# Altium project Rocket_PCB_Project_2017_Power_board.PrjPcb
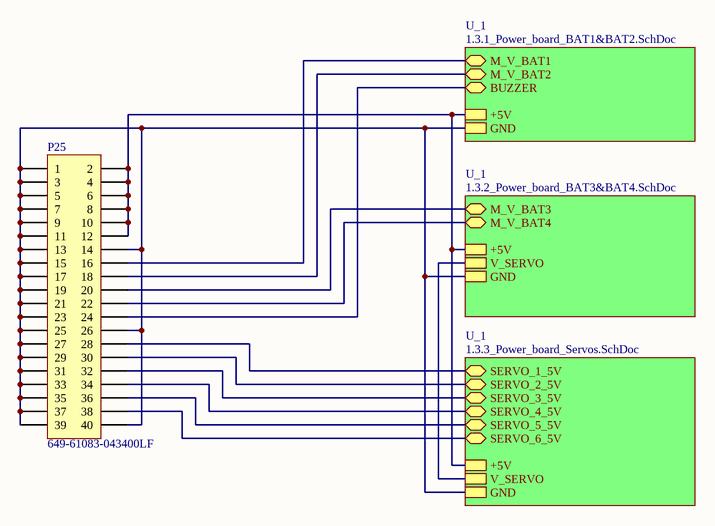
[diagram p0: 1.3.0_Power_board.SchDoc]
4 sheets, 132 parts. Net scope: hierarchical (ports join the sheet entries above them; power ports are global).
Board file: Power_board.PcbDoc
Sheets:
  1.3.0_Power_board.SchDoc
    U_1 = 1.3.3_Power_board_Servos.SchDoc
    U_1 = 1.3.1_Power_board_BAT1&BAT2.SchDoc
    U_1 = 1.3.2_Power_board_BAT3&BAT4.SchDoc

## Sheet 1.3.0_Power_board.SchDoc
size A4; DocumentNumber: 11; SheetNumber: 11; SheetTotal: 14

### Parts
P25  Supplier Part Number 1: 649-61083-043400LF  [61083-043400LF]  (hidden comment: 61083-043400LF)

### Sub-sheets
U_1 = 1.3.3_Power_board_Servos.SchDoc: SERVO_1_5V (bidir), SERVO_2_5V (bidir), SERVO_3_5V (bidir), SERVO_4_5V (bidir), SERVO_5_5V (bidir), SERVO_6_5V (bidir), GND, +5V, V_SERVO
U_1 = 1.3.1_Power_board_BAT1&BAT2.SchDoc: BUZZER (bidir), M_V_BAT1 (bidir), M_V_BAT2 (bidir), GND, +5V
U_1 = 1.3.2_Power_board_BAT3&BAT4.SchDoc: M_V_BAT3 (bidir), GND, +5V, M_V_BAT4 (bidir), V_SERVO

### Nets
+5V: P25.2 P25.4 P25.6 P25.8 P25.10 P25.12 ; sheet U_1/+5V, sheet U_1/+5V, sheet U_1/+5V
GND: P25.1 P25.3 P25.5 P25.7 P25.9 P25.11 P25.13 P25.14 P25.15 P25.17 P25.19 P25.21 P25.23 P25.25 P25.26 P25.27 P25.29 P25.31 P25.33 P25.35 P25.37 P25.39 P25.40 ; sheet U_1/GND, sheet U_1/GND, sheet U_1/GND
V_SERVO: sheet U_1/V_SERVO, sheet U_1/V_SERVO
NetC70_2: P25.16 ; sheet U_1/M_V_BAT1
NetC74_2: P25.18 ; sheet U_1/M_V_BAT2
NetC91_2: P25.20 ; sheet U_1/M_V_BAT3
NetC94_2: P25.22 ; sheet U_1/M_V_BAT4
NetP25_24: P25.24 ; sheet U_1/BUZZER
NetP25_28: P25.28 ; sheet U_1/SERVO_1_5V
NetP25_30: P25.30 ; sheet U_1/SERVO_2_5V
NetP25_32: P25.32 ; sheet U_1/SERVO_3_5V
NetP25_34: P25.34 ; sheet U_1/SERVO_4_5V
NetP25_36: P25.36 ; sheet U_1/SERVO_5_5V
NetP25_38: P25.38 ; sheet U_1/SERVO_6_5V

### Library data of the parts
P25 = 61083-043400LF: Connecteurs carte à carte et mezzanine PLUG 40P; Supplier 1: Mouser

## Sheet 1.3.3_Power_board_Servos.SchDoc
size A4; DocumentNumber: 14; SheetNumber: 14; SheetTotal: 14
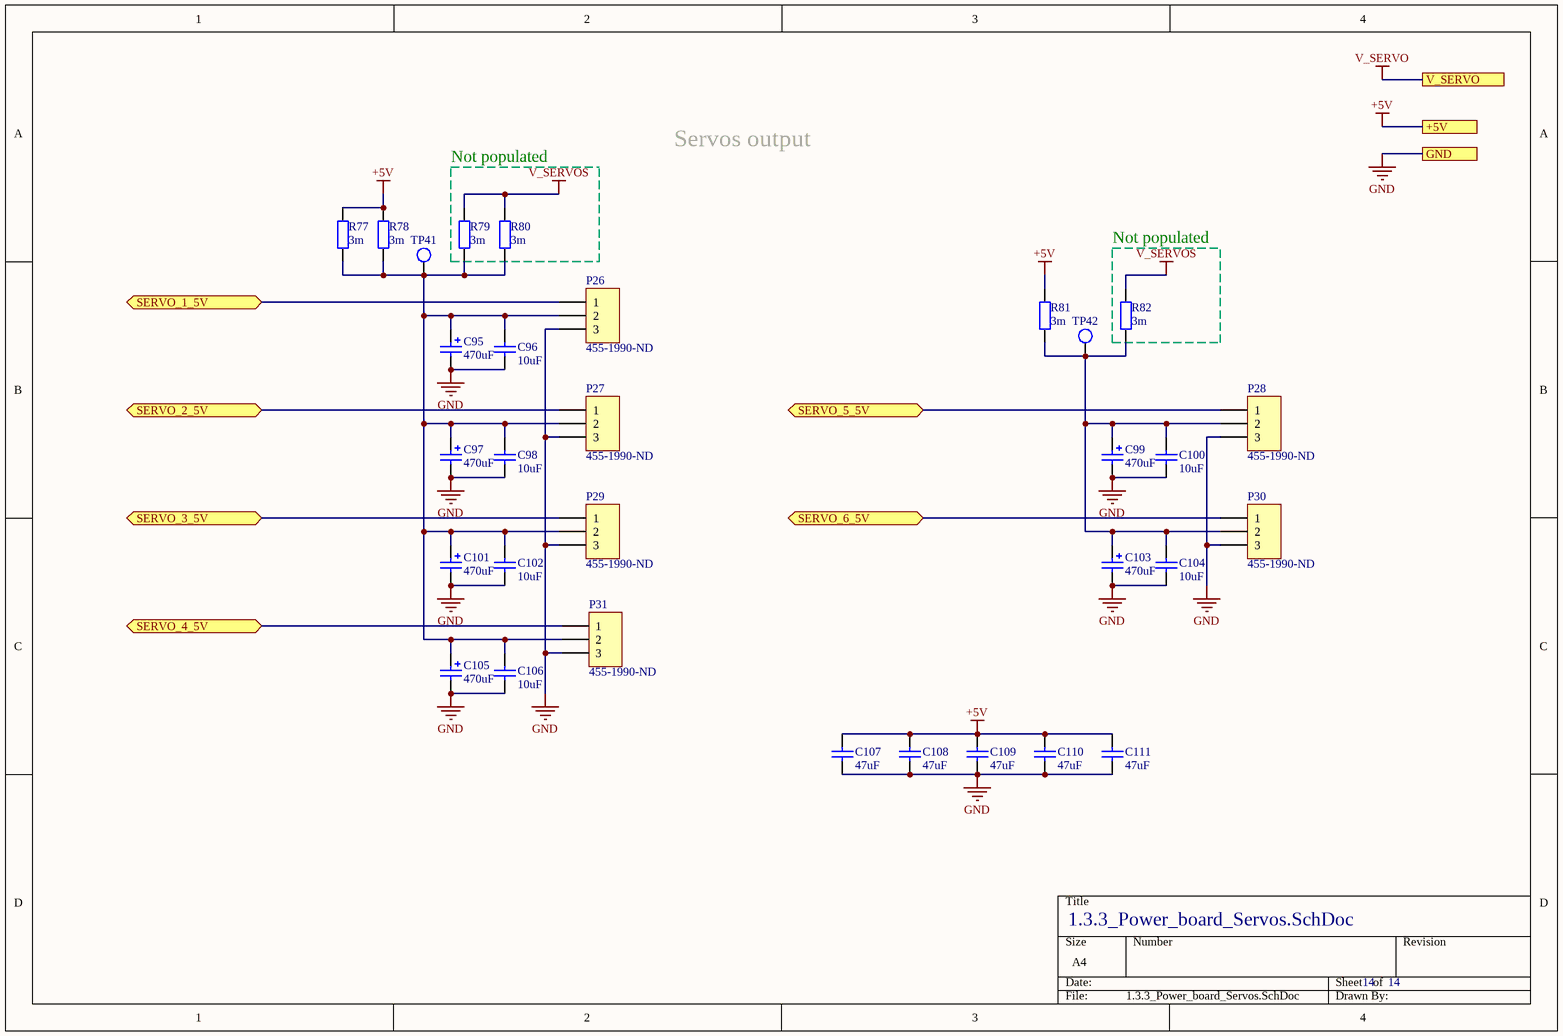
[diagram p1: 1.3.3_Power_board_Servos.SchDoc]

### Parts
C95  470uF  [PCV_10x10]
C96  10uF  [CAP0805W]
C97  470uF  [PCV_10x10]
C98  10uF  [CAP0805W]
C99  470uF  [PCV_10x10]
C100  10uF  [CAP0805W]
C101  470uF  [PCV_10x10]
C102  10uF  [CAP0805W]
C103  470uF  [PCV_10x10]
C104  10uF  [CAP0805W]
C105  470uF  [PCV_10x10]
C106  10uF  [CAP0805W]
C107  47uF  [CAP1206W]
C108  47uF  [CAP1206W]
C109  47uF  [CAP1206W]
C110  47uF  [CAP1206W]
C111  47uF  [CAP1206W]
P26  Supplier Part Number 1: 455-1990-ND  [CON_JST_XA_ B03B-XASK]  (hidden comment: Header 3p JST XA 3A)
P27  Supplier Part Number 1: 455-1990-ND  [CON_JST_XA_ B03B-XASK]  (hidden comment: Header 3p JST XA 3A)
P28  Supplier Part Number 1: 455-1990-ND  [CON_JST_XA_ B03B-XASK]  (hidden comment: Header 3p JST XA 3A)
P29  Supplier Part Number 1: 455-1990-ND  [CON_JST_XA_ B03B-XASK]  (hidden comment: Header 3p JST XA 3A)
P30  Supplier Part Number 1: 455-1990-ND  [CON_JST_XA_ B03B-XASK]  (hidden comment: Header 3p JST XA 3A)
P31  Supplier Part Number 1: 455-1990-ND  [CON_JST_XA_ B03B-XASK]  (hidden comment: Header 3p JST XA 3A)
R77  3m  [2010]
R78  3m  [2010]
R79  3m  [2010]
R80  3m  [2010]
R81  3m  [2010]
R82  3m  [2010]
TP41  Test point  [TP]  (value not drawn)
TP42  Test point  [TP]  (value not drawn)

### Blocks framed on the sheet
Not populated: R79 R80
Not populated: R82

### Ports
+5V, GND, SERVO_1_5V (bidir), SERVO_2_5V (bidir), SERVO_3_5V (bidir), SERVO_4_5V (bidir), SERVO_5_5V (bidir), SERVO_6_5V (bidir), V_SERVO

### Nets
+5V: C107.2 C108.2 C109.2 C110.2 C111.2 R77.2 R78.2 R81.2 ; port +5V
GND: C95.2 C96.1 C97.2 C98.1 C99.2 C100.1 C101.2 C102.1 C103.2 C104.1 C105.2 C106.1 C107.1 C108.1 C109.1 C110.1 C111.1 P26.3 P27.3 P28.3 P29.3 P30.3 P31.3 ; port GND
V_SERVOS: R79.2 R80.2 R82.2
NetC95_1: C95.1 C96.2 C97.1 C98.2 C101.1 C102.2 C105.1 C106.2 P26.2 P27.2 P29.2 P31.2 R77.1 R78.1 R79.1 R80.1 TP41.1
NetC99_1: C99.1 C100.2 C103.1 C104.2 P28.2 P30.2 R81.1 R82.1 TP42.1
NetP25_28: P26.1 ; port SERVO_1_5V
NetP25_30: P27.1 ; port SERVO_2_5V
NetP25_32: P29.1 ; port SERVO_3_5V
NetP25_34: P31.1 ; port SERVO_4_5V
NetP25_36: P28.1 ; port SERVO_5_5V
NetP25_38: P30.1 ; port SERVO_6_5V

### Notes on the sheet
- Servos output

### Library data of the parts
C95 C97 C99 C101 C103 C105 = C_pol_470uF_elec: Polarized Capacitor; Supplier 1: Mouser; Supplier Part Number 1: 647-UWT1E471MNL1S
C96 C98 C100 C102 C104 C106 = C_10uF_16v: Capacitor; Supplier 1: Mouser; Supplier Part Number 1: 81-GRT21BC81C106ME1L
C107-C111 = C_47uF_25v_1206: Capacitor; Supplier 1: Mouser; Supplier Part Number 1: 810-C3216X5R1E476M
R77-R82 = R_2010_2W_3mOhm: 2W 3mOhm; Supplier 1: Mouser; Supplier Part Number 1: 667-ERJ-MP3PF3M0U
P26-P31 = Header 3p JST XA 3A: Supplier 1: Digi-Key

## Sheet 1.3.1_Power_board_BAT1&BAT2.SchDoc
size A4; DocumentNumber: 12; SheetNumber: 12; SheetTotal: 14
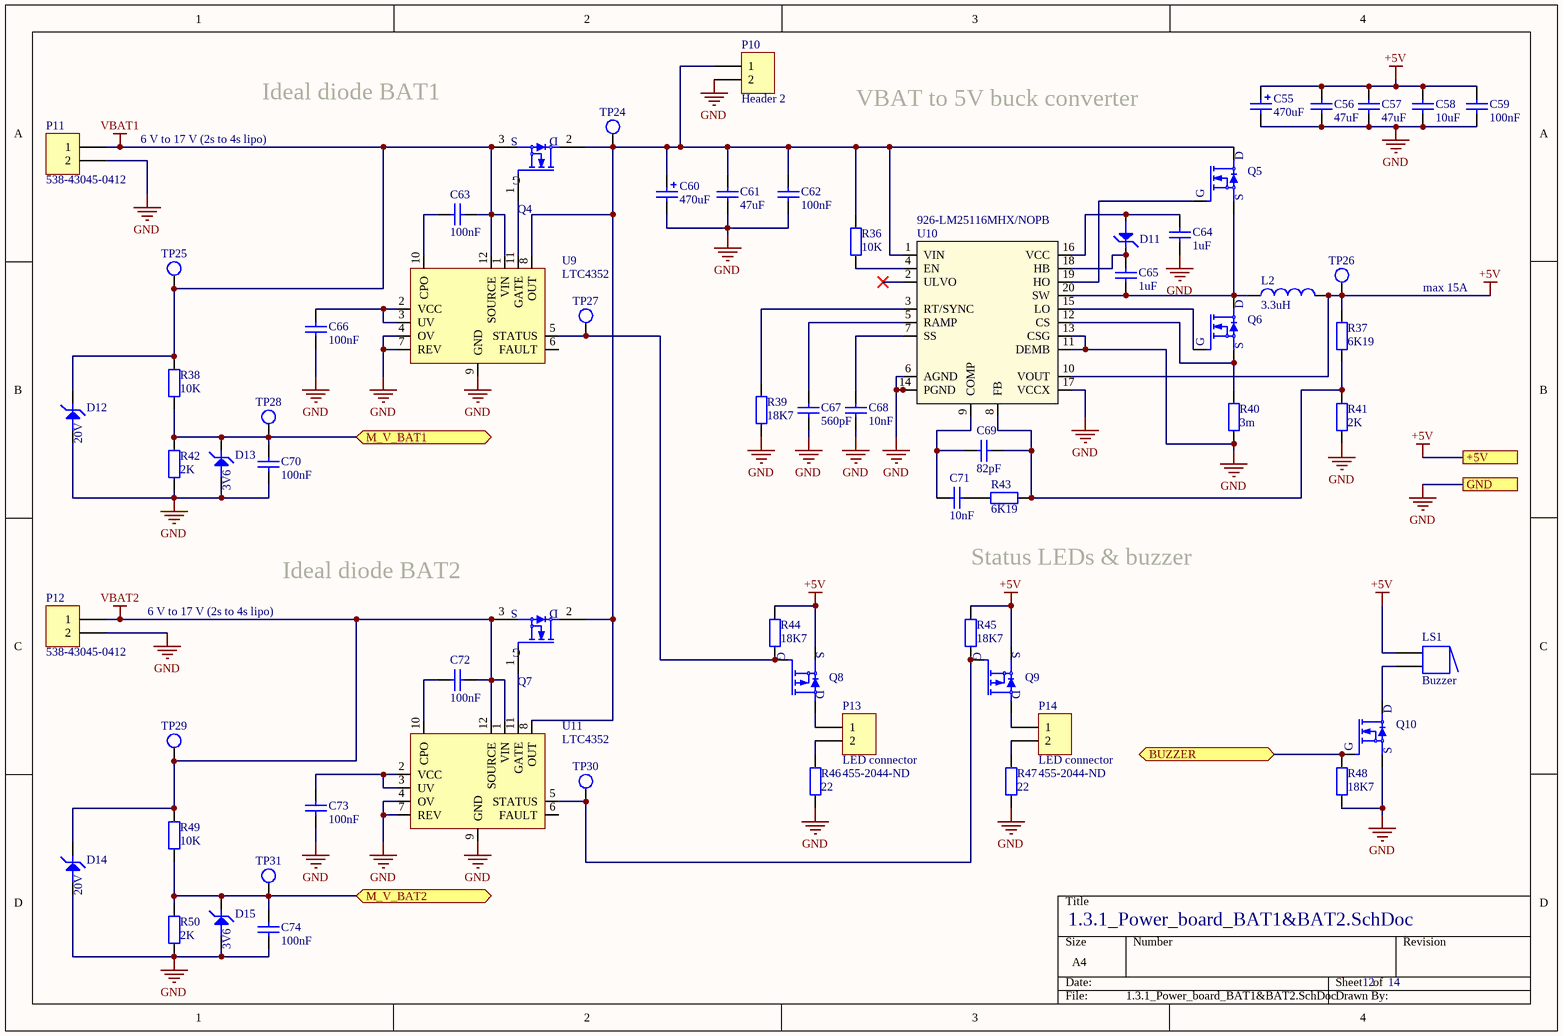
[diagram p2: 1.3.1_Power_board_BAT1&BAT2.SchDoc]

### Parts
C55  470uF  [PCV_10x10]
C56  47uF  [CAP1206W]
C57  47uF  [CAP1206W]
C58  10uF  [CAP0805W]
C59  100nF  [CAP0603R]
C60  470uF  [PCV_10x10]
C61  47uF  [CAP1206W]
C62  100nF  [CAP0603R]
C63  100nF  [CAP0603R]
C64  1uF  [CAP0603R]
C65  1uF  [CAP0603R]
C66  100nF  [CAP0603R]
C67  560pF  [CAP0603R]
C68  10nF  [CAP0603R]
C69  82pF  [CAP0603R]
C70  100nF  [CAP0603R]
C71  10nF  [CAP0603R]
C72  100nF  [CAP0603R]
C73  100nF  [CAP0603R]
C74  100nF  [CAP0603R]
D11  DS_NRVB0530T3G  [SOD123]  (value not drawn)
D12  20V  [DO-214AA]
D13  3V6  [SOT23]
D14  20V  [DO-214AA]
D15  3V6  [SOT23]
L2  3.3uH  [IHLP_Inductor]
LS1  Buzzer  [CT-1205C-SMT]
P10  Header 2  [Con Prov 2P Power]
P11  Supplier Part Number 1: 538-43045-0412  [Con 2P Power and MicroFit 4P]  (hidden comment: Header MicroFit 2)
P12  Supplier Part Number 1: 538-43045-0412  [Con 2P Power and MicroFit 4P]  (hidden comment: Header MicroFit 2)
P13  LED connector  Supplier Part Number 1: 455-2044-ND  [CON_JST_XA_ S02B-XASS-1]
P14  LED connector  Supplier Part Number 1: 455-2044-ND  [CON_JST_XA_ S02B-XASS-1]
Q4  MOSFET_N  [TO220]  (value not drawn)
Q5  MOSFET_N  [TO252]  (value not drawn)
Q6  MOSFET_N  [TO252]  (value not drawn)
Q7  MOSFET_N  [TO220]  (value not drawn)
Q8  MOSFET_P  [SOT23]  (value not drawn)
Q9  MOSFET_P  [SOT23]  (value not drawn)
Q10  MOSFET_N  [SOT-323-3]  (value not drawn)
R36  10K  [0603]
R37  6K19  [0603]
R38  10K  [0603]
R39  18K7  [0603]
R40  3m  [2010]
R41  2K  [0603]
R42  2K  [0603]
R43  6K19  [0603]
R44  18K7  [0603]
R45  18K7  [0603]
R46  22  [0603]
R47  22  [0603]
R48  18K7  [0603]
R49  10K  [0603]
R50  2K  [0603]
TP24  Test point  [TP]  (value not drawn)
TP25  Test point  [TP]  (value not drawn)
TP26  Test point  [TP]  (value not drawn)
TP27  Test point  [TP]  (value not drawn)
TP28  Test point  [TP]  (value not drawn)
TP29  Test point  [TP]  (value not drawn)
TP30  Test point  [TP]  (value not drawn)
TP31  Test point  [TP]  (value not drawn)
U9  LTC4352  [TSOP612]
U10  Supplier Part Number 1: 926-LM25116MHX/NOPB  [HTSSOP 20]  (hidden comment: LM25116MHX/NOPB)
U11  LTC4352  [TSOP612]

### Ports
+5V, BUZZER (bidir), GND, M_V_BAT1 (bidir), M_V_BAT2 (bidir)

### Nets
+5V: C55.1 C56.2 C57.2 C58.2 C59.2 L2.2 LS1.1 Q8.2(S) Q9.2(S) R37.2 R44.2 R45.2 TP26.1 U10.10(VOUT) ; port +5V
GND: C55.2 C56.1 C57.1 C58.1 C59.1 C60.2 C61.1 C62.1 C64.1 C66.1 C67.1 C68.1 C70.1 C73.1 C74.1 D12.A D13.1 D14.A D15.1 P10.2 P11.2 P12.2 Q10.2(S) R39.1 R40.1 R41.1 R42.1 R46.1 R47.1 R48.1 R50.1 U9.4(OV) U9.7(REV) U9.9(GND) U10.6(AGND) U10.11(DEMB) U10.13(CSG) U10.14(PGND) U10.17(VCCX) U10.21(EP) U11.4(OV) U11.7(REV) U11.9(GND) ; port GND
VBAT1: C63.1 D12.C P11.1 Q4.3(S) R38.2 TP25.1 U9.1(VIN) U9.12(SOURCE)
VBAT2: C72.1 D14.C P12.1 Q7.3(S) R49.2 TP29.1 U11.1(VIN) U11.12(SOURCE)
NetC60_1: C60.1 C61.2 C62.2 P10.1 Q4.2(D) Q5.D Q7.2(D) R36.2 TP24.1 U9.8(OUT) U10.1(VIN) U11.8(OUT)
NetC63_2: C63.2 U9.10(CPO)
NetC64_2: C64.2 D11.2 U10.16(VCC)
NetC65_1: C65.1 L2.1 Q5.S Q6.D U10.20(SW)
NetC65_2: C65.2 D11.1 U10.18(HB)
NetC66_2: C66.2 U9.2(VCC) U9.3(UV)
NetC67_2: C67.2 U10.5(RAMP)
NetC68_2: C68.2 U10.7(SS)
NetC69_1: C69.1 R37.1 R41.2 R43.2 U10.8(FB)
NetC69_2: C69.2 C71.2 U10.9(COMP)
NetC70_2: C70.2 D13.3 R38.1 R42.2 TP28.1 ; port M_V_BAT1
NetC71_1: C71.1 R43.1
NetC72_2: C72.2 U11.10(CPO)
NetC73_2: C73.2 U11.2(VCC) U11.3(UV)
NetC74_2: C74.2 D15.3 R49.1 R50.2 TP31.1 ; port M_V_BAT2
NetLS1_2: LS1.2 Q10.3(D)
NetP13_1: P13.1 Q8.3(D)
NetP13_2: P13.2 R46.2
NetP14_1: P14.1 Q9.3(D)
NetP14_2: P14.2 R47.2
NetP25_24: Q10.1(G) R48.2 ; port BUZZER
NetQ4_1: Q4.1(G) U9.11(GATE)
NetQ5_G: Q5.G U10.19(HO)
NetQ6_G: Q6.G U10.15(LO)
NetQ6_S: Q6.S R40.2 U10.12(CS)
NetQ7_1: Q7.1(G) U11.11(GATE)
NetQ8_1: Q8.1(G) R44.1 TP27.1 U9.5(STATUS)
NetQ9_1: Q9.1(G) R45.1 TP30.1 U11.5(STATUS)
NetR36_1: R36.1 U10.4(EN)
NetR39_2: R39.2 U10.3(RT/SYNC)

Not connected (* = marked no-connect by the designer): U9 6(FAULT); U10 2(ULVO)*; U11 6(FAULT)

### Notes on the sheet
- Ideal diode BAT1
- VBAT to 5V buck converter
- 6 V to 17 V (2s to 4s lipo)
- max 15A
- (near Q7) Ideal diode BAT2
- Status LEDs & buzzer

### Library data of the parts
C55 C60 = C_pol_470uF_elec: Polarized Capacitor; Supplier 1: Mouser; Supplier Part Number 1: 647-UWT1E471MNL1S
C56 C57 C61 = C_47uF_25v_1206: Capacitor; Supplier 1: Mouser; Supplier Part Number 1: 810-C3216X5R1E476M
C58 = C_10uF_16v: Capacitor; Supplier 1: Mouser; Supplier Part Number 1: 81-GRT21BC81C106ME1L
C59 C62 C63 C66 C70 C72-C74 = C_100nF: Capacitor; Supplier 1: Mouser; Supplier Part Number 1: 81-GCG188R91H104KA1D
C64 C65 = C_1uF_50v: Capacitor; Supplier 1: Mouser; Supplier Part Number 1: 81-GRT188R61H105ME3D
C67 = C_560pF_50V: Capacitor; Supplier 1: Mouser; Supplier Part Number 1: 81-GCM1885C1H561JA6D
C68 C71 = C_10nF: Capacitor; Supplier 1: Mouser; Supplier Part Number 1: 81-GCG188R91H103KA3D
C69 = C_82pF_50V: Capacitor; Supplier 1: Mouser; Supplier Part Number 1: 81-GCM1885C1H820JA6D
D12 D14 = DZ_20V: Zener Diodes 5W 20V; Supplier 1: Mouser; Supplier Part Number 1: 833-SMBJ5357B-TP
D13 D15 = DZ_3V6_MMBZ522: Zener Diodes 3.6V 225mW; Supplier 1: Mouser; Supplier Part Number 1: 863-MMBZ5227BLT1G
L2 = L_3.3uH: Inductor; Supplier 1: Mouser; Supplier Part Number 1: 70-IHLP6767DZER3R3M1
LS1 = Buzzer_CT-1205C-SMT-TR: Magnetic Transducer Buzzer 5VDC; Supplier 1: Mouser; Supplier Part Number 1: 490-CT-1205C-SMT-TR
P10 = Header 2: Juste pour tester!!!
P11 P12 = MicroFit and other Headers 2p: Supplier 1: Mouser
P13 P14 = Header 2p JST XA 3A right angle: Supplier 1: Digi-Key
Q4 Q7 = MOSFET_IPP029N06NAKSA1: Supplier 1: Mouser; Supplier Part Number 1: 726-IPP029N06NAKSA1
Q5 Q6 = MOSFET_DMTH4007LK3-13: Supplier 1: Mouser; Supplier Part Number 1: 621-DMTH4007LK3-13
Q8 Q9 = MOSFET_P_ 20V_1.5A: MOSFET 40V P-channel Trench MOSFET SOT-23-3; Supplier 1: Mouser; Supplier Part Number 1: 771-PMV250EPEAR
Q10 = MOSFET_N_ 20V_1.4A: MOSFET N-Ch 20V 1.4A SOT-323-3; Supplier 1: Mouser; Supplier Part Number 1: 726-SP000917562
R36 R38 R49 = R_0603_01W_10K: 0.1W 10K; Supplier 1: Mouser; Supplier Part Number 1: 667-ERJ-3GEYJ103V
R37 R43 = R_0603_01W_6K2: 0.1W 6K19; Supplier 1: Mouser; Supplier Part Number 1: 667-ERJ-3EKF6191V
R39 R44 R45 R48 = R_0603_01W_18K7: 0.1W 18K7; Supplier 1: Mouser; Supplier Part Number 1: 667-ERJ-3EKF1872V
R40 = R_2010_2W_3mOhm: 2W 3mOhm; Supplier 1: Mouser; Supplier Part Number 1: 667-ERJ-MP3PF3M0U
R41 R42 R50 = R_0603_01W_2K: 0.1W 2K; Supplier 1: Mouser; Supplier Part Number 1: 667-ERJ-3EKF2001V
R46 R47 = R_0603_025W_22Ohm: 0.25W 22Ohm; LatestRevisionDate: 17-Jul-2002; LatestRevisionNote: Re-released for DXP Platform.; PackageReference: AXIAL-0.4; PackageDescription: Axial Device, Thru-Hole; 2 Leads; 0.4 in Pin Spacing; Supplier 1: Mouser; Supplier Part Number 1: 667-ERJ-PA3J220V
U10 = LM25116MHX/NOPB: WIDE RANGE SYNC BUCK; Supplier 1: Mouser
D11 = DS_NRVB0530T3G: Supplier 1: Mouser; Supplier Part Number 1: 863-NRVB0530T3G
U9 U11 = LTC4352: Supplier 1: Digi-Key; Supplier Part Number 1: LTC4352IMS#PBF-ND

## Sheet 1.3.2_Power_board_BAT3&BAT4.SchDoc
size A4; DocumentNumber: 13; SheetNumber: 13; SheetTotal: 14
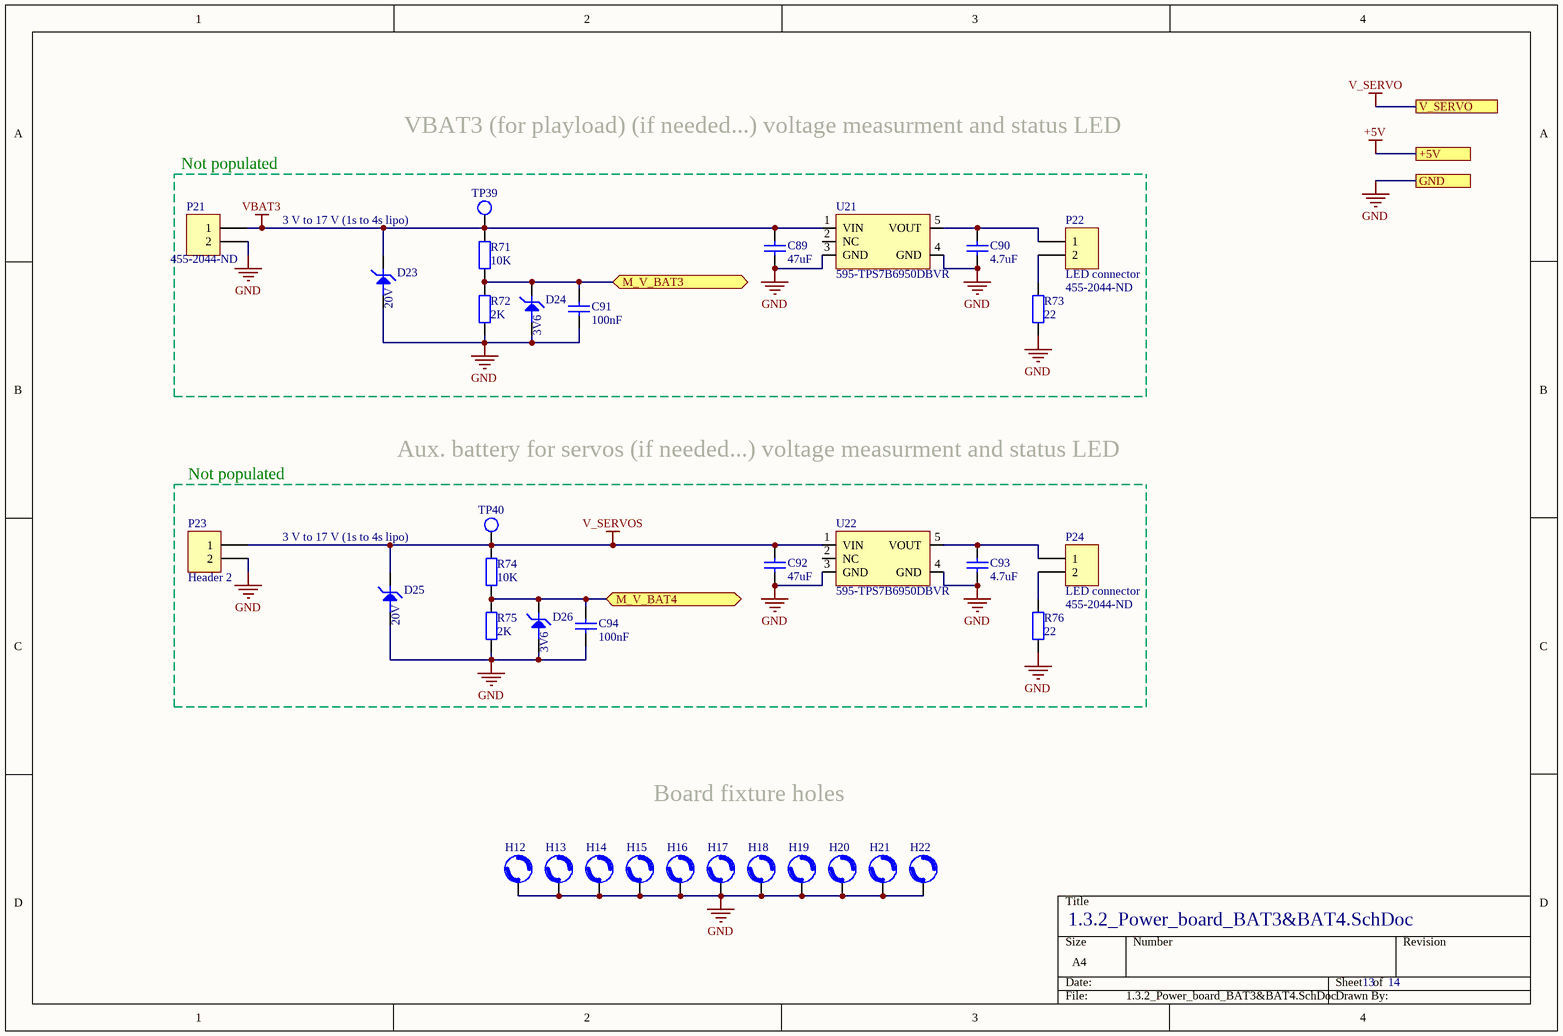
[diagram p3: 1.3.2_Power_board_BAT3&BAT4.SchDoc]

### Parts
C89  47uF  [CAP1206W]
C90  4.7uF  [CAP0805W]
C91  100nF  [CAP0603R]
C92  47uF  [CAP1206W]
C93  4.7uF  [CAP0805W]
C94  100nF  [CAP0603R]
D23  20V  [DO-214AA]
D24  3V6  [SOT23]
D25  20V  [DO-214AA]
D26  3V6  [SOT23]
H12  Hole_3.2mm  [HOLE_3.2mm]  (value not drawn)
H13  Hole_3.2mm  [HOLE_3.2mm]  (value not drawn)
H14  Hole_3.2mm  [HOLE_3.2mm]  (value not drawn)
H15  Hole_3.2mm  [HOLE_3.2mm]  (value not drawn)
H16  Hole_3.2mm  [HOLE_3.2mm]  (value not drawn)
H17  Hole_3.2mm  [HOLE_3.2mm]  (value not drawn)
H18  Hole_3.2mm  [HOLE_3.2mm]  (value not drawn)
H19  Hole_3.2mm  [HOLE_3.2mm]  (value not drawn)
H20  Hole_3.2mm  [HOLE_3.2mm]  (value not drawn)
H21  Hole_3.2mm  [HOLE_3.2mm]  (value not drawn)
H22  Hole_3.2mm  [HOLE_3.2mm]  (value not drawn)
P21  Supplier Part Number 1: 455-2044-ND  [CON_JST_XA_ S02B-XASS-1]
P22  LED connector  Supplier Part Number 1: 455-2044-ND  [CON_JST_XA_ S02B-XASS-1]
P23  Header 2  [Con Prov 2P Power]
P24  LED connector  Supplier Part Number 1: 455-2044-ND  [CON_JST_XA_ S02B-XASS-1]
R71  10K  [0603]
R72  2K  [0603]
R73  22  [0603]
R74  10K  [0603]
R75  2K  [0603]
R76  22  [0603]
TP39  Test point  [TP]  (value not drawn)
TP40  Test point  [TP]  (value not drawn)
U21  Supplier Part Number 1: 595-TPS7B6950DBVR  [SOT-23-5]  (hidden comment: TPS7B6950D)
U22  Supplier Part Number 1: 595-TPS7B6950DBVR  [SOT-23-5]  (hidden comment: TPS7B6950D)

### Blocks framed on the sheet
Not populated: C89-C91 D23 D24 P21 P22 R71-R73 TP39 U21
Not populated: C92-C94 D25 D26 P23 P24 R74-R76 TP40 U22

### Ports
+5V, GND, M_V_BAT3 (bidir), M_V_BAT4 (bidir), V_SERVO

### Nets
GND: C89.1 C90.1 C91.1 C92.1 C93.1 C94.1 D23.A D24.1 D25.A D26.1 H12.0 H13.0 H14.0 H15.0 H16.0 H17.0 H18.0 H19.0 H20.0 H21.0 H22.0 P21.2 P23.2 R72.1 R73.1 R75.1 R76.1 U21.3(GND) U21.4(GND) U22.3(GND) U22.4(GND) ; port GND
V_SERVOS: C92.2 D25.C P23.1 R74.2 TP40.1 U22.1(VIN)
VBAT3: C89.2 D23.C P21.1 R71.2 TP39.1 U21.1(VIN)
NetC90_2: C90.2 P22.1 U21.5(VOUT)
NetC91_2: C91.2 D24.3 R71.1 R72.2 ; port M_V_BAT3
NetC93_2: C93.2 P24.1 U22.5(VOUT)
NetC94_2: C94.2 D26.3 R74.1 R75.2 ; port M_V_BAT4
NetP22_2: P22.2 R73.2
NetP24_2: P24.2 R76.2

Not connected (* = marked no-connect by the designer): U21 2(NC); U22 2(NC)

### Notes on the sheet
- VBAT3 (for playload) (if needed...) voltage measurment and status LED
- 3 V to 17 V (1s to 4s lipo)
- Aux. battery for servos (if needed...) voltage measurment and status LED
- Board fixture holes

### Library data of the parts
C89 C92 = C_47uF_25v_1206: Capacitor; Supplier 1: Mouser; Supplier Part Number 1: 810-C3216X5R1E476M
C90 C93 = C_4.7uF_16v: Capacitor; Supplier 1: Mouser; Supplier Part Number 1: 81-GCG21BR71C475KA2L
C91 C94 = C_100nF: Capacitor; Supplier 1: Mouser; Supplier Part Number 1: 81-GCG188R91H104KA1D
D23 D25 = DZ_20V: Zener Diodes 5W 20V; Supplier 1: Mouser; Supplier Part Number 1: 833-SMBJ5357B-TP
D24 D26 = DZ_3V6_MMBZ522: Zener Diodes 3.6V 225mW; Supplier 1: Mouser; Supplier Part Number 1: 863-MMBZ5227BLT1G
P21 P22 P24 = Header 2p JST XA 3A right angle: Supplier 1: Digi-Key
P23 = Header 2: Juste pour tester!!!
R71 R74 = R_0603_01W_10K: 0.1W 10K; Supplier 1: Mouser; Supplier Part Number 1: 667-ERJ-3GEYJ103V
R72 R75 = R_0603_01W_2K: 0.1W 2K; Supplier 1: Mouser; Supplier Part Number 1: 667-ERJ-3EKF2001V
R73 R76 = R_0603_025W_22Ohm: 0.25W 22Ohm; LatestRevisionDate: 17-Jul-2002; LatestRevisionNote: Re-released for DXP Platform.; PackageReference: AXIAL-0.4; PackageDescription: Axial Device, Thru-Hole; 2 Leads; 0.4 in Pin Spacing; Supplier 1: Mouser; Supplier Part Number 1: 667-ERJ-PA3J220V
U21 U22 = TPS7B6950D: LDO 5V 150mA; Supplier 1: Mouser

## Nets that join several sheets
+5V: 1.3.0_Power_board (6 pins), 1.3.3_Power_board_Servos (8 pins), 1.3.1_Power_board_BAT1&BAT2 (14 pins)
GND: 1.3.0_Power_board (23 pins), 1.3.3_Power_board_Servos (23 pins), 1.3.1_Power_board_BAT1&BAT2 (43 pins), 1.3.2_Power_board_BAT3&BAT4 (31 pins)
V_SERVOS: 1.3.3_Power_board_Servos (R79.2 R80.2 R82.2), 1.3.2_Power_board_BAT3&BAT4 (6 pins)
NetC70_2: 1.3.0_Power_board (P25.16), 1.3.1_Power_board_BAT1&BAT2 (5 pins)
NetC74_2: 1.3.0_Power_board (P25.18), 1.3.1_Power_board_BAT1&BAT2 (5 pins)
NetC91_2: 1.3.0_Power_board (P25.20), 1.3.2_Power_board_BAT3&BAT4 (C91.2 D24.3 R71.1 R72.2)
NetC94_2: 1.3.0_Power_board (P25.22), 1.3.2_Power_board_BAT3&BAT4 (C94.2 D26.3 R74.1 R75.2)
NetP25_24: 1.3.0_Power_board (P25.24), 1.3.1_Power_board_BAT1&BAT2 (Q10.1 R48.2)
NetP25_28: 1.3.0_Power_board (P25.28), 1.3.3_Power_board_Servos (P26.1)
NetP25_30: 1.3.0_Power_board (P25.30), 1.3.3_Power_board_Servos (P27.1)
NetP25_32: 1.3.0_Power_board (P25.32), 1.3.3_Power_board_Servos (P29.1)
NetP25_34: 1.3.0_Power_board (P25.34), 1.3.3_Power_board_Servos (P31.1)
NetP25_36: 1.3.0_Power_board (P25.36), 1.3.3_Power_board_Servos (P28.1)
NetP25_38: 1.3.0_Power_board (P25.38), 1.3.3_Power_board_Servos (P30.1)